# Altium schematic sheet projectxecanbang.SchDoc
size A4
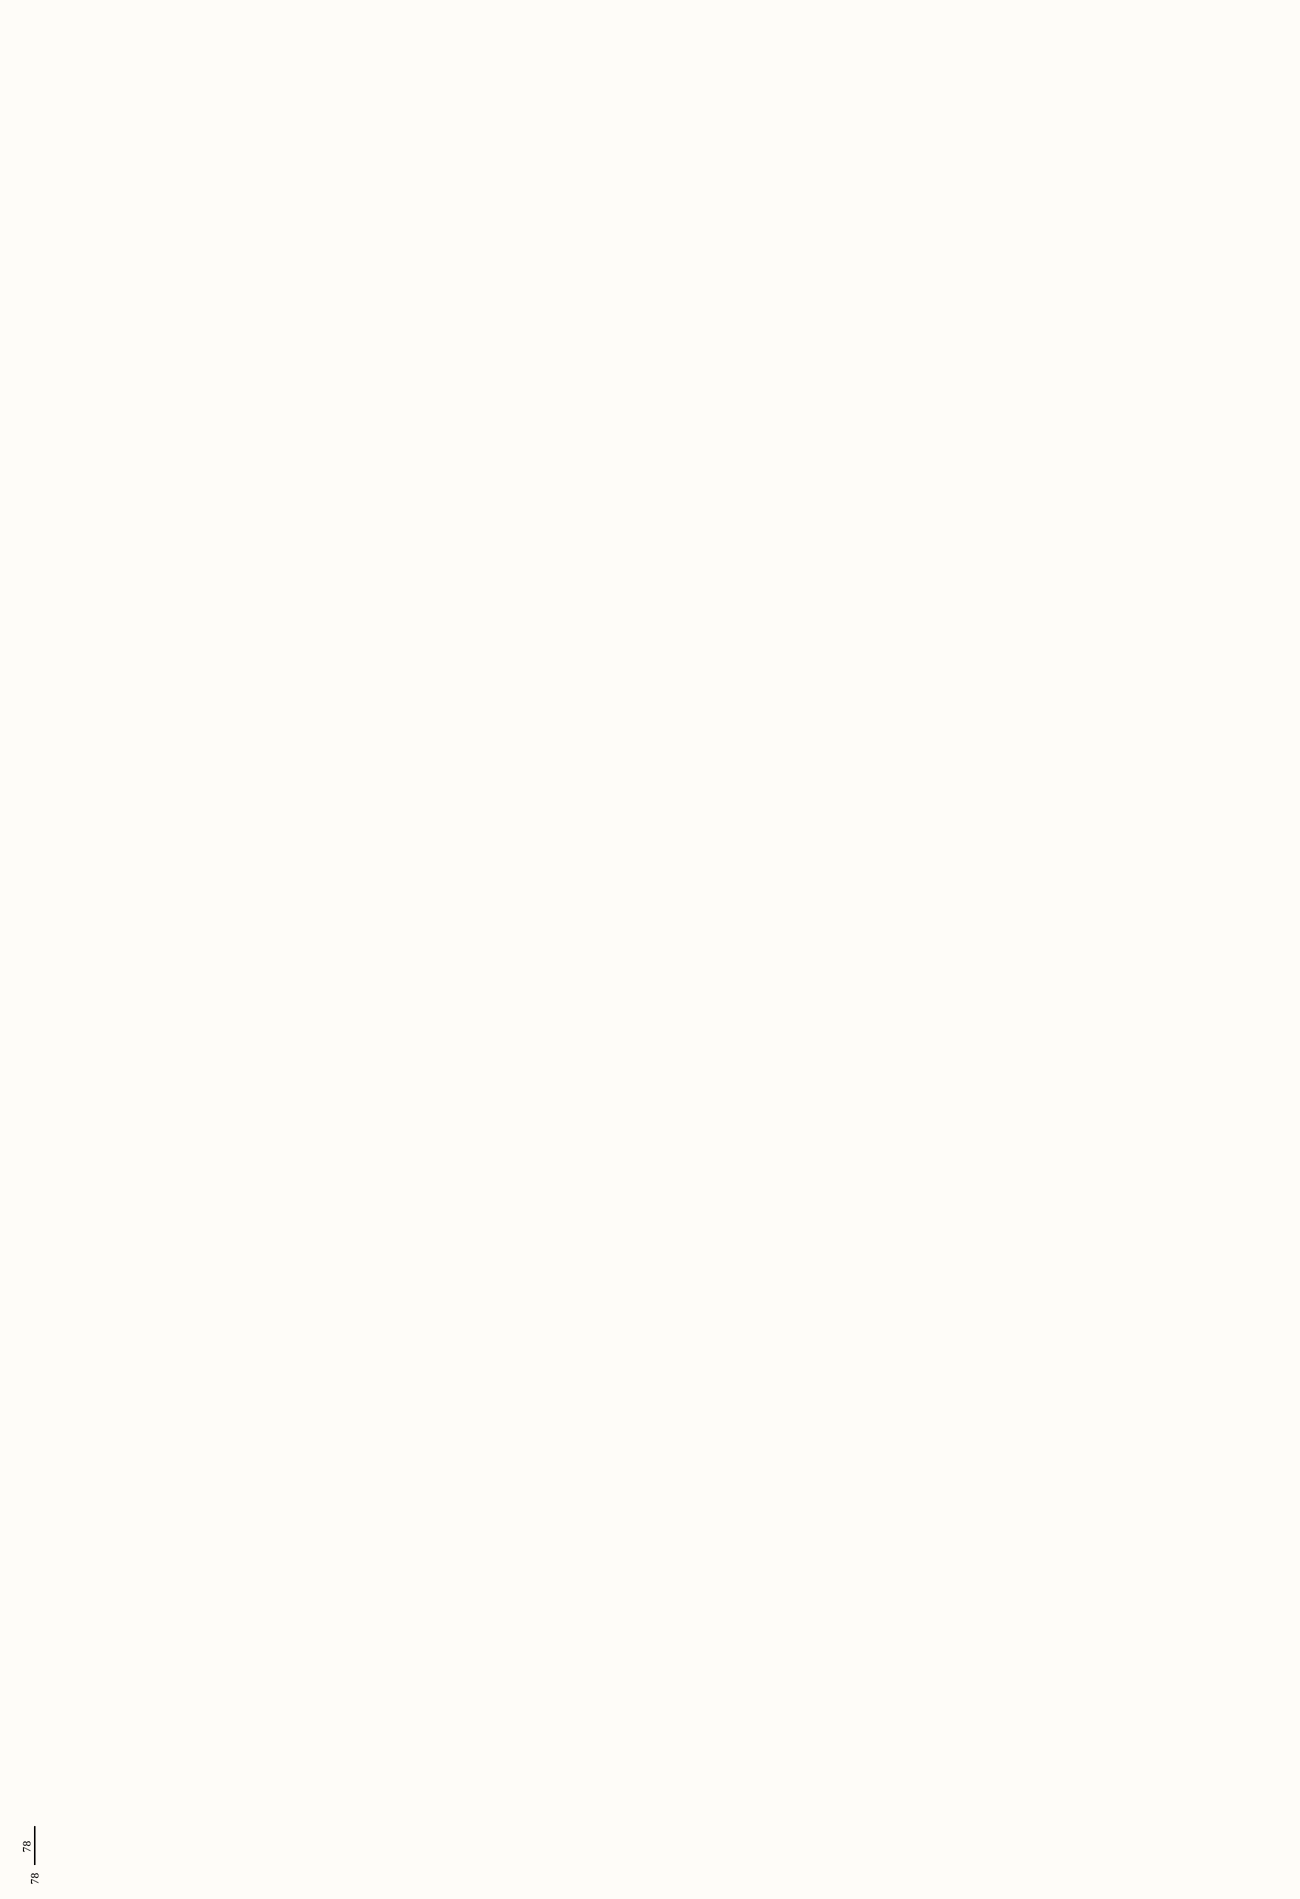
[diagram p0: projectxecanbang.SchDoc, left]
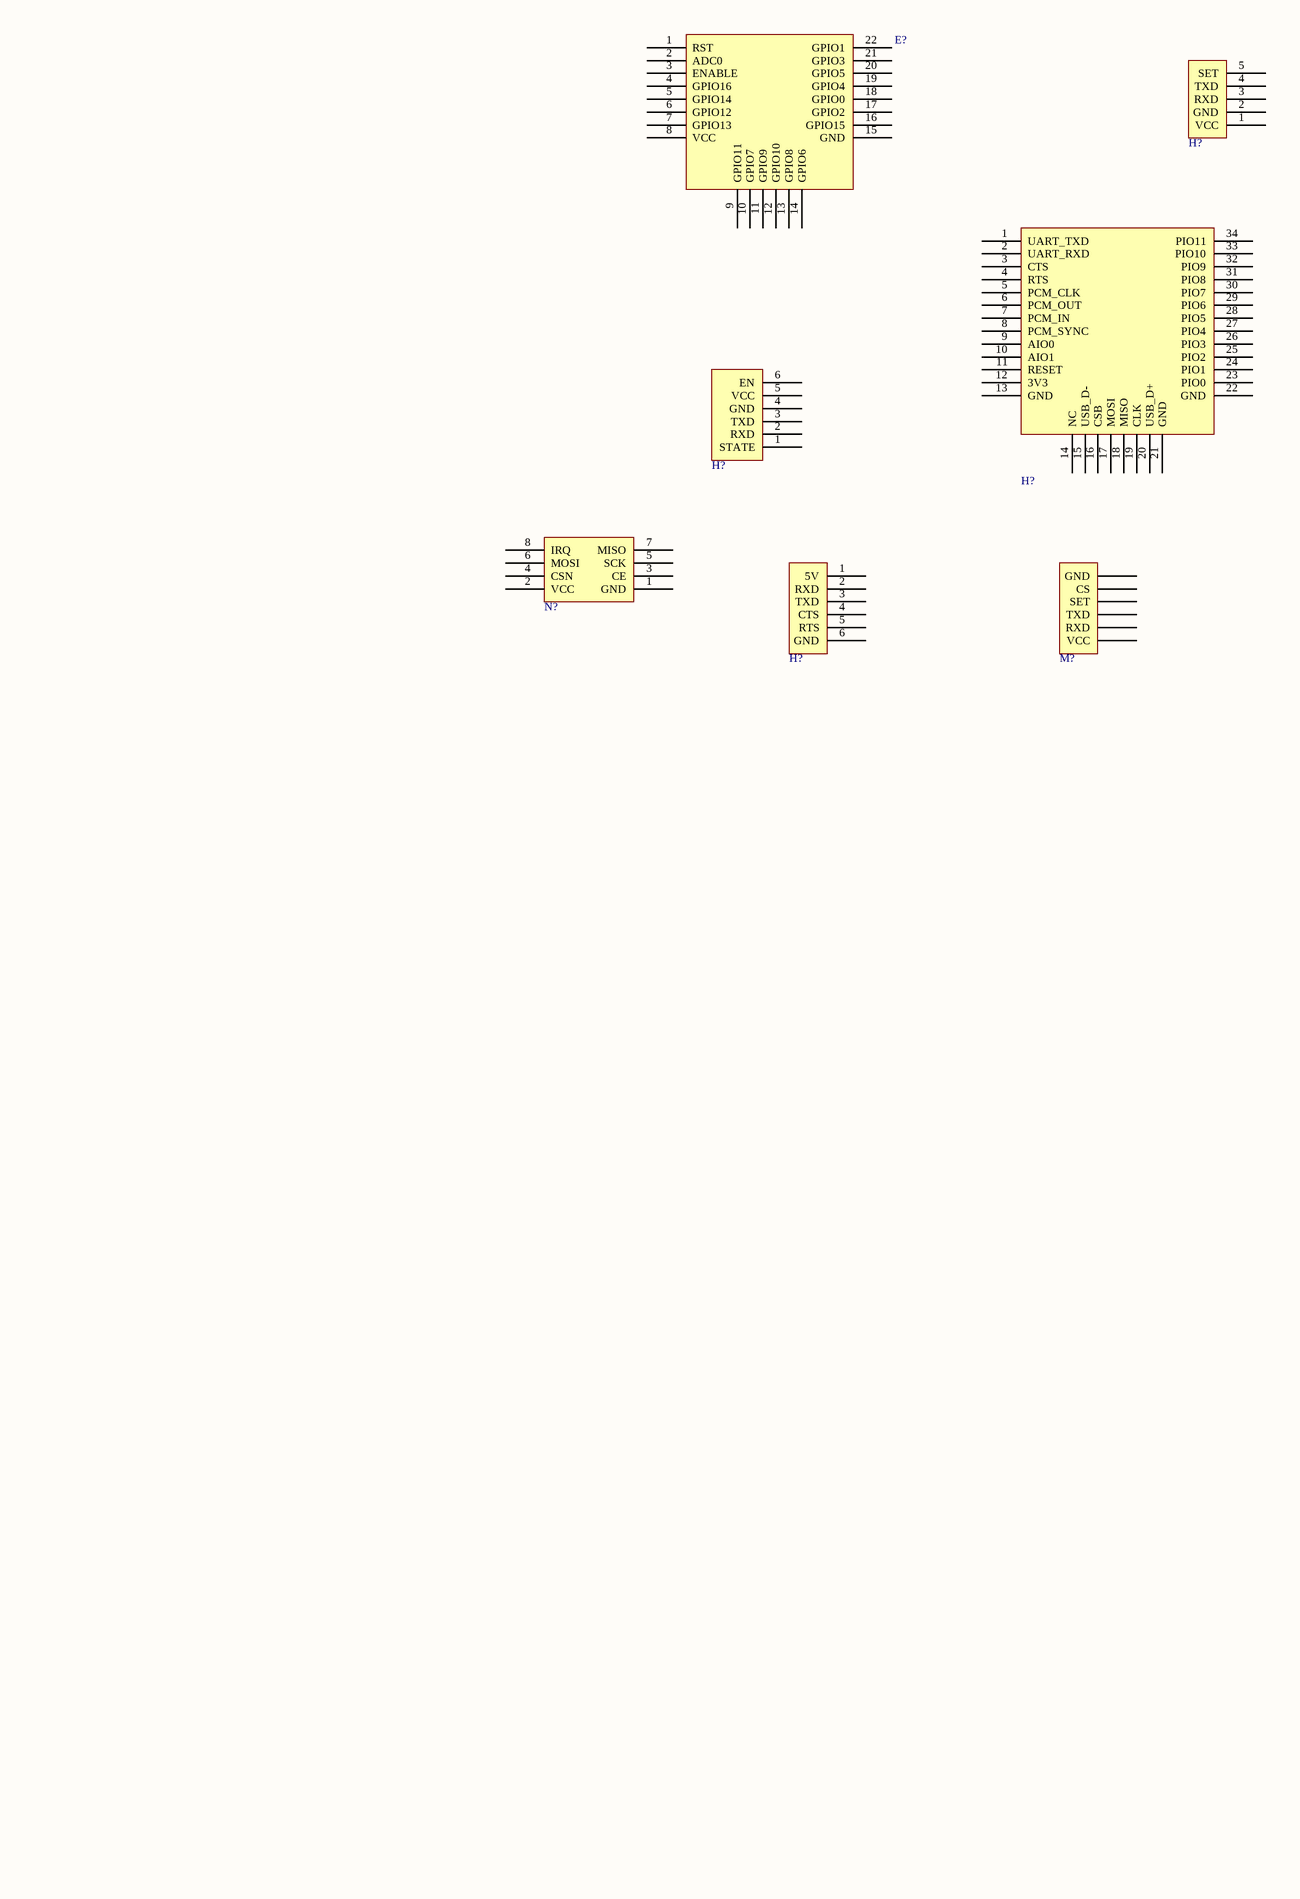
[diagram p1: projectxecanbang.SchDoc, right]

## Parts
(Parts that share a designator on the sheet are numbered #1, #2 ... from top to bottom, then left to right.)
E?  ESP8266-12F  [ESP8266-12F]  (value not drawn)
H?#1  HC12  [HC12]  (value not drawn)
H?#2  HC-05-06-SMD  [HC-05-06-SMD]  (value not drawn)
H?#3  HC-05-06-TH  [HC-05-06-TH]  (value not drawn)
H?#4  Holybro Radio  [Holybro-RADIO]  (value not drawn)
M?  LC12S  [LC12S]  (value not drawn)
N?  NRF24L01  [NRF24L01]  (value not drawn)

## Nets

Not connected (* = marked no-connect by the designer): E? 1(RST) 2(ADC0) 3(ENABLE) 4(GPIO16) 5(GPIO14) 6(GPIO12) 7(GPIO13) 8(VCC) 9(GPIO11) 10(GPIO7) 11(GPIO9) 12(GPIO10) 13(GPIO8) 14(GPIO6) 15(GND) 16(GPIO15) 17(GPIO2) 18(GPIO0) 19(GPIO4) 20(GPIO5) 21(GPIO3) 22(GPIO1) 78; H?#1 1(VCC) 2(GND) 3(RXD) 4(TXD) 5(SET); H?#2 1(UART_TXD) 2(UART_RXD) 3(CTS) 4(RTS) 5(PCM_CLK) 6(PCM_OUT) 7(PCM_IN) 8(PCM_SYNC) 9(AIO0) 10(AIO1) 11(RESET) 12(3V3) 13(GND) 14(NC) 15(USB_D-) 16(CSB) 17(MOSI) 18(MISO) 19(CLK) 20(USB_D+) 21(GND) 22(GND) 23(PIO0) 24(PIO1) 25(PIO2) 26(PIO3) 27(PIO4) 28(PIO5) 29(PIO6) 30(PIO7) 31(PIO8) 32(PIO9) 33(PIO10) 34(PIO11); H?#3 1(STATE) 2(RXD) 3(TXD) 4(GND) 5(VCC) 6(EN); H?#4 1(5V) 2(RXD) 3(TXD) 4(CTS) 5(RTS) 6(GND); M? 1(VCC) 2(RXD) 3(TXD) 4(SET) 5(CS) 6(GND); N? 1(GND) 2(VCC) 3(CE) 4(CSN) 5(SCK) 6(MOSI) 7(MISO) 8(IRQ)

## Library data of the parts
E? = ESP8266-12F: Local Supplier: HShop; Local Supplier Link: https://hshop.vn/products/mach-thu-phat-wifi-soc-esp8266-v12; Local Supplier Part Number: HS000912; Manufacturer: *; Manufacturer Part Number: *
H?#1 = HC12: Local Supplier: HShop; Local Supplier Link: https://hshop.vn/products/mach-thu-phat-rf-uart-si4463-433mhzkhoang-coch-1km; Local Supplier Part Number: HS000897; Manufacturer: *; Manufacturer Part Number: *
H?#2 = HC-05-06-SMD: Local Supplier: HShop; Local Supplier Link: https://hshop.vn/products/mach-thu-phat-bluetooth-hc-06-chua-ra-chon-slave; Local Supplier Part Number: HS000881; Manufacturer: *; Manufacturer Part Number: *
H?#3 = HC-05-06-TH: Local Supplier: HShop; Local Supplier Link: https://hshop.vn/products/mach-thu-phat-bluetooth-hc-06-do-ra-chon-slave; Local Supplier Part Number: HS000882; Manufacturer: *; Manufacturer Part Number: *
H?#4 = Holybro Radio: Local Supplier: HShop; Local Supplier Link: *; Local Supplier Part Number: *; Manufacturer: *; Manufacturer Part Number: *
M? = LC12S: Local Supplier: HShop; Local Supplier Link: https://hshop.vn/products/mach-thu-phat-rf-uart-lc12s-2-4ghz?fbclid=IwAR26O0qUYvAaxZyOD_fV7zzf2od6t2O22eUH8MkuJUU9SmcdCCf5BpKqTRM; Local Supplier Part Number: HS000895; Manufacturer: *; Manufacturer Part Number: *
N? = NRF24L01: Local Supplier: HShop; Local Supplier Link: https://hshop.vn/products/mach-thu-phat-rf-nrf24l01-pa-lna-nrf-e04; Local Supplier Part Number: HS000888; Manufacturer: *; Manufacturer Part Number: *